# Altium schematic sheet Filter.SchDoc
size A3; SheetNumber: 1; SheetTotal: 1
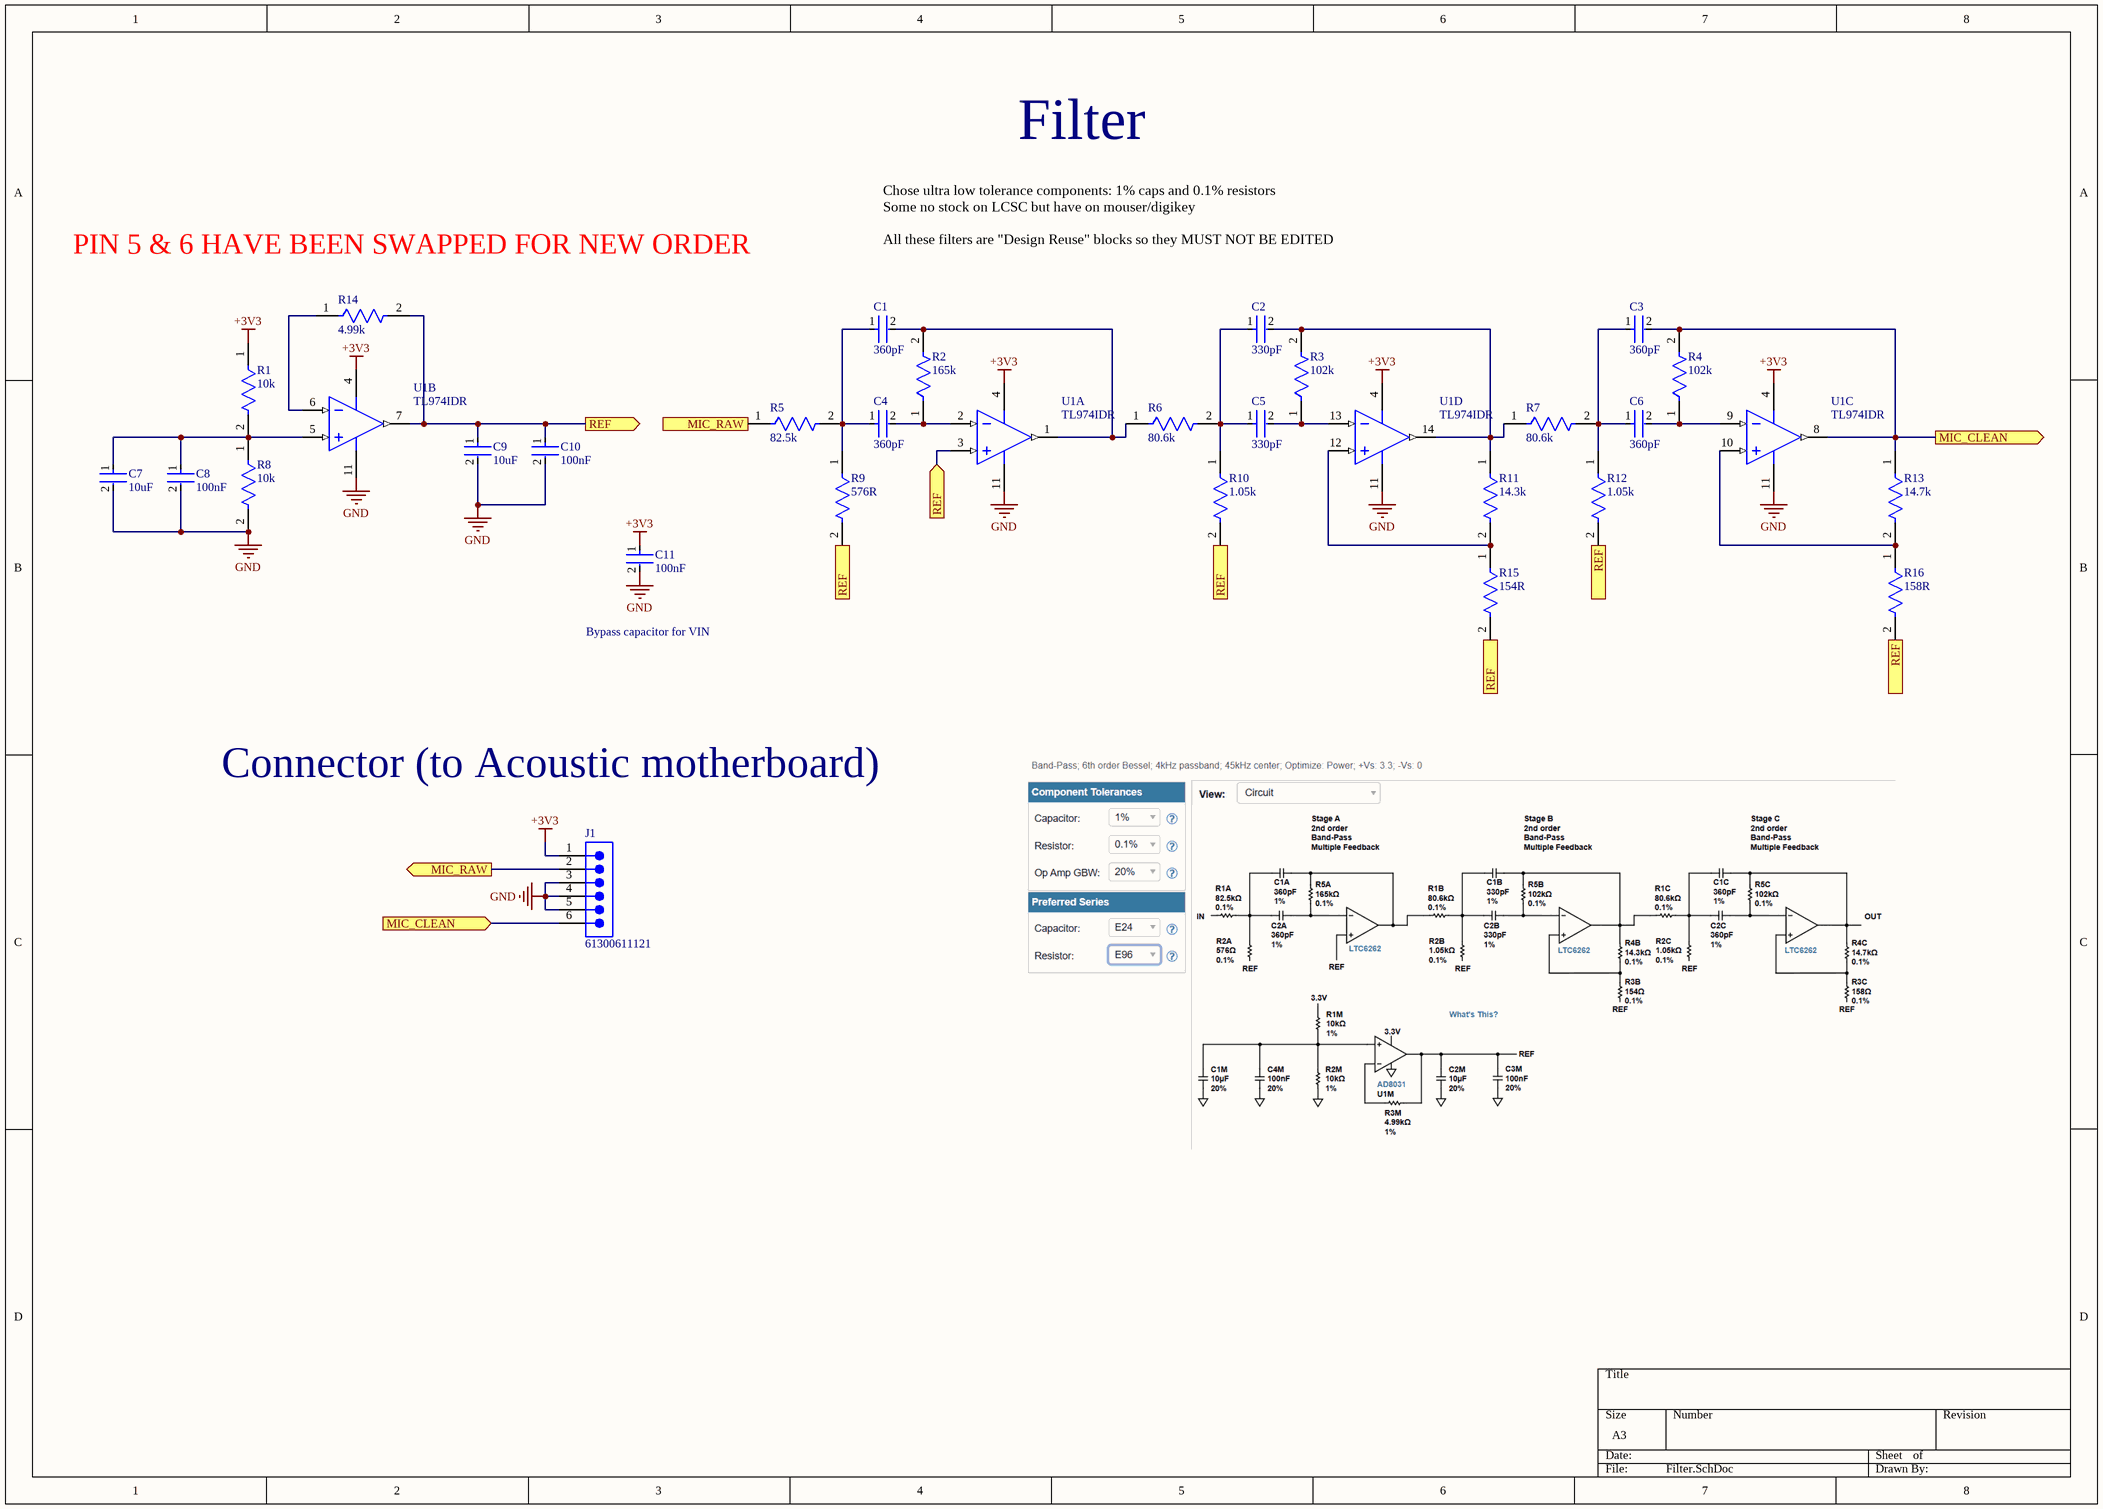
[diagram p0: Filter.SchDoc]

## Parts
C1  360pF  [FP-GCM188-0_1-IPC_B]
C2  330pF  [FP-GCM188-0_1-IPC_B]
C3  360pF  [FP-GCM188-0_1-IPC_B]
C4  360pF  [FP-GCM188-0_1-IPC_B]
C5  330pF  [FP-GCM188-0_1-IPC_B]
C6  360pF  [FP-GCM188-0_1-IPC_B]
C7  10uF  [FP-GCM188-0_1-IPC_B]
C8  100nF  [FP-GCM188-0_1-IPC_B]
C9  10uF  [FP-GCM188-0_1-IPC_B]
C10  100nF  [FP-GCM188-0_1-IPC_B]
C11  100nF  [FP-GCM188-0_1-IPC_B]
J1  61300611121  [61300611121-Footprint-1]
R1  10k  [FP-RT0603-IPC_B]
R2  165k  [FP-RT0603-IPC_B]
R3  102k  [FP-RT0603-IPC_B]
R4  102k  [FP-RT0603-IPC_B]
R5  82.5k  [FP-RT0603-IPC_B]
R6  80.6k  [FP-RT0603-IPC_B]
R7  80.6k  [FP-RT0603-IPC_B]
R8  10k  [FP-RT0603-IPC_B]
R9  576R  [FP-RT0603-IPC_B]
R10  1.05k  [FP-RT0603-IPC_B]
R11  14.3k  [FP-RT0603-IPC_B]
R12  1.05k  [FP-RT0603-IPC_B]
R13  14.7k  [FP-RT0603-IPC_B]
R14  4.99k  [FP-RT0603-IPC_B]
R15  154R  [FP-RT0603-IPC_B]
R16  158R  [FP-RT0603-IPC_B]
U1  TL974IDR  [D0014A_N]  (parts A,B,C,D of 4)

## Ports
MIC_CLEAN (in, see Filter[8B]), MIC_CLEAN (out, see Filter[2C]), MIC_RAW (in, see Filter[2C]), MIC_RAW (out, see Filter[3B]), REF (in, see Filter[3B], Filter[4B], Filter[5B], Filter[6B], Filter[7B]), REF (in, see Filter[3B], Filter[4B], Filter[5B], Filter[6B], Filter[7B], Filter[8B]), REF (in, see Filter[3B], Filter[4B], Filter[5B], Filter[6B], Filter[8B]), REF (in, see Filter[3B], Filter[4B], Filter[5B], Filter[7B], Filter[8B]), REF (in, see Filter[3B], Filter[4B], Filter[6B], Filter[7B], Filter[8B]), REF (out, see Filter[4B], Filter[5B], Filter[6B], Filter[7B], Filter[8B])

## Nets
+3V3: C11.1 J1.1 R1.1 U1.4(VCC+)
GND: C7.2 C8.2 C9.2 C10.2 C11.2 J1.3 J1.4 J1.5 R8.2 U1.11(VCC-)
MIC_CLEAN: C3.2 J1.6 R4.2 R13.1 U1.8(OUT3) ; port MIC_CLEAN
MIC_RAW: J1.2 R5.1 ; port MIC_RAW
REF: C9.1 C10.1 R9.2 R10.2 R12.2 R14.2 R15.2 R16.2 U1.3(IN1+) U1.7(OUT2) ; port REF
NetC1_1: C1.1 C4.1 R5.2 R9.1
NetC1_2: C1.2 R2.2 R6.1 U1.1(OUT1)
NetC2_1: C2.1 C5.1 R6.2 R10.1
NetC2_2: C2.2 R3.2 R7.1 R11.1 U1.14(OUT4)
NetC3_1: C3.1 C6.1 R7.2 R12.1
NetC4_2: C4.2 R2.1 U1.2(IN1-)
NetC5_2: C5.2 R3.1 U1.13(IN4-)
NetC6_2: C6.2 R4.1 U1.9(IN3-)
NetC7_1: C7.1 C8.1 R1.2 R8.1 U1.5(IN2+)
NetR11_2: R11.2 R15.1 U1.12(IN4+)
NetR13_2: R13.2 R16.1 U1.10(IN3+)
NetR14_1: R14.1 U1.6(IN2-)

## Notes on the sheet
- Filter
- Chose ultra low tolerance components: 1% caps and 0.1% resistors
  Some no stock on LCSC but have on mouser/digikey
  All these filters are "Design Reuse" blocks so they MUST NOT BE EDITED
- PIN 5 & 6 HAVE BEEN SWAPPED FOR NEW ORDER
- Bypass capacitor for VIN
- Connector (to Acoustic motherboard)

## Library data of the parts
C1 C3 C4 C6 = CMP-00016-1: Ceramic Capacitor, Multilayer, Ceramic, 100V, 1% +Tol, 1% -Tol, C0G, 30ppm/Cel TC, 0.00036uF, Surface Mount, 0603; Reference Standard: AEC-Q200; Multilayer: Yes; Packaging: Tape and Reel; Case/Package: 0603; Pins: 2; Temperature Characteristics Code: C0G; Termination: Wraparound; Min Operating Temperature: -55°C; Max Operating Temperature: 125°C; Capacitor Type: Ceramic; Value: 360pF; Tolerance (fill in as +-): 1%; RoHS Compliant: Yes; Dielectric Material: Ceramic; Rated DC Voltage (URdc): 100V; Reach SVHC Compliant: Yes; Mounting Technology: Surface Mount; Tolerance  (fill in as +-): 1%; Package Shape: Rectangular
C2 C5 = CMP-00012-1: Ceramic Capacitor, Multilayer, Ceramic, 50V, 1% +Tol, 1% -Tol, C0G, -/+30ppm/Cel TC, 0.00033uF, Surface Mount, 0603; Manufacturer Series: GRM18; Multilayer: Yes; Capacitor Type: Ceramic; Package Shape: Rectangular; Case/Package: 0603; Terminal Finish: Tin; Tolerance (fill in as +-): 1%; Packaging: Tape and Reel; Mounting Technology: Surface Mount; Max Operating Temperature: 125°C; Dielectric Material: Ceramic; Termination: Wraparound; Value: 330pF; Tolerance  (fill in as +-): 1%; Reach SVHC Compliant: Yes; RoHS Compliant: Yes; Min Operating Temperature: -55°C; JESD-609 Code: e3; Rated DC Voltage (URdc): 50V; Temperature Characteristics Code: C0G; Pins: 2
C7 C9 = CMP-00036-2: 25V 10uF Ceramic Capacitor, Multilayer, Ceramic, 25V, 10% +Tol, 10% -Tol, X5R, 15% TC, 10uF, Surface Mount, 0603; Multilayer: Yes; Max Operating Temperature: 85°C; Termination: Wraparound; Tolerance  (fill in as +-): 10%; Case/Package: 0603; Terminal Finish: Nickel; Pins: 2; Packaging: Tape and Reel; Temperature Characteristics Code: X5R; Value: 10uF; JESD-609 Code: e3; Mounting Technology: Surface Mount; Reach SVHC Compliant: Yes; Min Operating Temperature: -55°C; RoHS Compliant: Yes; Package Shape: Rectangular; Tolerance (fill in as +-): 10%; Capacitor Type: Ceramic; Dielectric Material: Ceramic; Rated DC Voltage (URdc): 25V
C8 C10 C11 = CMP-00033-2: 50V 100nF Ceramic Capacitor, Multilayer, Ceramic, 50V, 10% +Tol, 10% -Tol, X7R, 15% TC, 0.1uF, Surface Mount, 0603; Multilayer: Yes; Max Operating Temperature: 125°C; Tolerance (fill in as +-): 10%; Packaging: Tape and Reel; Min Operating Temperature: -55°C; Package Style: SMTMeter; Termination: Wraparound; Pins: 2; Dielectric Material: Ceramic; Temperature Characteristics Code: X7R; JESD-609 Code: e3; Width: 0.8mm; Rated DC Voltage (URdc): 50V; Package Shape: Rectangular; Case/Package: 0603; Length: 1.6mm; Height: 0.8mm; Reach SVHC Compliant: Yes; Value: 100nF; Capacitor Type: Ceramic; Tolerance  (fill in as +-): 10%; Terminal Finish: Nickel; Mounting Technology: Surface Mount; RoHS Compliant: Yes
J1 = CMP-00041-2: 6P Single Row 2.54mm Wurth Elektronik Header Pin (inverted 3D model); Reference Standard: UL; Dielectric Withstanding Voltage (AC): 500V; Contact Resistance: 20mR; Contact Style: SQ PIN-SKT; Mating Contact Pitch: 0.1inch; Contact Pattern: RECTANGULAR; Insulation Resistance: 1GR; Reliability: COMMERCIAL; Body Length: 0.6inch; Connector Type: BOARD CONNECTOR; Number of Contacts: 6; Rated Current (Signal): 3A; Mounting Option 1: LOCKING; Body/Shell Style: PLUG; Number Of Connectors: 1; System: Connector; RoHS Compliant: Yes; Contact Material: Copper Alloy; Min Operating Temperature: -40°C; Contact Finish - Termination: Gold (Au) - with Nickel (Ni) barrier; Terminal Length: 0.118inch; Contact Finish - Mating: GOLD; JESD-609 Code: e4; Body Depth: 0.1inch; Insulation Material: Polybutylene; Reach SVHC Compliant: Yes; Terminal Pitch: 2.54mm; PCB Contact Pattern: RECTANGULAR; Max Operating Temperature: 125°C; Mounting Style: STRAIGHT; Contact Gender: Male; Body Breadth: 0.1inch; Number of Rows Loaded: 1; Termination: Solder; Insulation Color: Black; Mounting Technology: Board
R1 R8 = CMP-00035-1: 10k 1% Fixed Resistor, Metal Glaze/thick Film, 0.1W, 10000ohm, 75V, 1% +/-Tol, 100ppm/Cel, Surface Mount, 0603; Power: 100mW; Temperature Coefficient (ppm/Cel): 100; Package Height: 0.45mm; Package Length: 1.6mm; Additional Feature: LASER TRIMMABLE; Package Width: 0.8mm; Value: 10kR; Rated Temperature: 70°C; Construction: Chip; Resistor Type: FIXED RESISTOR; Terminal Finish: Nickel; Mounting Technology: Surface Mount; Technology: METAL GLAZE/THICK FILM; Min Operating Temperature: -55°C; Pins: 2; Termination: Wraparound; Working Voltage: 75V; RoHS Compliant: Yes; Packaging: Tape and Reel; Case/Package: 0603; JESD-609 Code: e3; Package Shape: Rectangular; Reach SVHC Compliant: Yes; Max Operating Temperature: 155°C; Tolerance: 1%
R2 = CMP-00023-1: 165k Fixed Resistor, Thin Film, 0.1W, 165000ohm, 75V, 0.1% +/-Tol, 25ppm/Cel, Surface Mount, 0603; Rated Temperature: 70°C; Power: 100mW; Package Width: 0.8mm; Package Height: 0.45mm; Temperature Coefficient (ppm/Cel): 25; Value: 165kR; Package Length: 1.6mm; Min Operating Temperature: -55°C; Working Voltage: 75V; Termination: Wraparound; Pins: 2; Tolerance: 0.1%; Construction: Chip; Reach SVHC Compliant: Yes; Case/Package: 0603; Technology: THIN FILM; Resistor Type: FIXED RESISTOR; Packaging: Tape and Reel; RoHS Compliant: Yes; Mounting Technology: Surface Mount; Max Operating Temperature: 155°C
R3 R4 = CMP-00011-2: 102k Fixed Resistor, Thin Film, 0.1W, 102000ohm, 75V, 0.1% +/-Tol, 25ppm/Cel, Surface Mount, 0603; Package Length: 1.6mm; Value: 102kR; Package Width: 0.8mm; Power: 100mW; Temperature Coefficient (ppm/Cel): 25; Package Height: 0.45mm; Rated Temperature: 70°C; Pins: 2; RoHS Compliant: Yes; Mounting Technology: Surface Mount; Packaging: Tape and Reel; Min Operating Temperature: -55°C; Max Operating Temperature: 155°C; Tolerance: 0.1%; Resistor Type: FIXED RESISTOR; Case/Package: 0603; Technology: THIN FILM; Construction: Chip; Working Voltage: 75V; Termination: Wraparound; Reach SVHC Compliant: Yes
R5 = CMP-00022-2: 82.5k Fixed Resistor, Thin Film, 0.1W, 82500ohm, 75V, 0.1% +/-Tol, 25ppm/Cel, Surface Mount, 0603; Package Width: 0.8mm; Rated Temperature: 70°C; Value: 82.5kR; Temperature Coefficient (ppm/Cel): 25; Package Height: 0.45mm; Power: 100mW; Package Length: 1.6mm; Pins: 2; Working Voltage: 75V; Packaging: Tape and Reel; Construction: Chip; Reach SVHC Compliant: Yes; Tolerance: 0.1%; Termination: Wraparound; Technology: THIN FILM; Case/Package: 0603; Max Operating Temperature: 155°C; Min Operating Temperature: -55°C; Mounting Technology: Surface Mount; Resistor Type: FIXED RESISTOR; RoHS Compliant: Yes
R6 R7 = CMP-00025-2: 80.6k Fixed Resistor, Thin Film, 0.1W, 80600ohm, 75V, 0.1% +/-Tol, 25ppm/Cel, Surface Mount, 0603; Package Width: 0.8mm; Package Height: 0.45mm; Power: 100mW; Value: 80.6kR; Temperature Coefficient (ppm/Cel): 25; Package Length: 1.6mm; Rated Temperature: 70°C; Working Voltage: 75V; Mounting Technology: Surface Mount; Technology: THIN FILM; Construction: Chip; Tolerance: 0.1%; Reach SVHC Compliant: Yes; Resistor Type: FIXED RESISTOR; Pins: 2; Packaging: Tape and Reel; Max Operating Temperature: 155°C; Termination: Wraparound; RoHS Compliant: Yes; Min Operating Temperature: -55°C; Case/Package: 0603
R9 = CMP-00024-2: 576R Fixed Resistor, Thin Film, 0.1W, 576ohm, 75V, 0.1% +/-Tol, 25ppm/Cel, Surface Mount, 0603; Power: 100mW; Package Height: 0.45mm; Package Length: 1.6mm; Temperature Coefficient (ppm/Cel): 25; Rated Temperature: 70°C; Package Width: 0.8mm; RoHS Compliant: Yes; Mounting Technology: Surface Mount; Technology: THIN FILM; Value: 576R; Resistor Type: FIXED RESISTOR; Max Operating Temperature: 155°C; Termination: Wraparound; Pins: 2; Tolerance: 0.1%; Packaging: Tape and Reel; Reach SVHC Compliant: Yes; Min Operating Temperature: -55°C; Case/Package: 0603; Construction: Chip; Working Voltage: 75V
R10 R12 = CMP-00026-2: 1.05k Fixed Resistor, Thin Film, 0.1W, 1050ohm, 75V, 0.1% +/-Tol, 25ppm/Cel, Surface Mount, 0603; Package Width: 0.8mm; Rated Temperature: 70°C; Package Height: 0.45mm; Package Length: 1.6mm; Value: 1.05kR; Temperature Coefficient (ppm/Cel): 25; Power: 100mW; Mounting Technology: Surface Mount; Pins: 2; Max Operating Temperature: 155°C; Packaging: Tape and Reel; Tolerance: 0.1%; Reach SVHC Compliant: Yes; Construction: Chip; Working Voltage: 75V; Min Operating Temperature: -55°C; Termination: Wraparound; RoHS Compliant: Yes; Resistor Type: FIXED RESISTOR; Technology: THIN FILM; Case/Package: 0603
R11 = CMP-00029-1: 14.3k Fixed Resistor, Thin Film, 0.1W, 14300ohm, 75V, 0.1% +/-Tol, 25ppm/Cel, Surface Mount, 0603; Temperature Coefficient (ppm/Cel): 25; Value: 14.3kR; Package Width: 0.8mm; Rated Temperature: 70°C; Power: 100mW; Package Length: 1.6mm; Package Height: 0.45mm; Construction: Chip; Max Operating Temperature: 155°C; RoHS Compliant: Yes; Technology: THIN FILM; Mounting Technology: Surface Mount; Min Operating Temperature: -55°C; Working Voltage: 75V; Case/Package: 0603; Pins: 2; Resistor Type: FIXED RESISTOR; Tolerance: 0.1%; Packaging: Tape and Reel; Termination: Wraparound; Reach SVHC Compliant: Yes
R13 = CMP-00027-2: 14.7k Fixed Resistor, Thin Film, 0.1W, 14700ohm, 75V, 0.1% +/-Tol, 25ppm/Cel, Surface Mount, 0603; Rated Temperature: 70°C; Temperature Coefficient (ppm/Cel): 25; Package Height: 0.45mm; Package Width: 0.8mm; Value: 14.7kR; Package Length: 1.6mm; Power: 100mW; Termination: Wraparound; Tolerance: 0.1%; Pins: 2; Mounting Technology: Surface Mount; Case/Package: 0603; Min Operating Temperature: -55°C; Resistor Type: FIXED RESISTOR; Construction: Chip; Packaging: Tape and Reel; Technology: THIN FILM; Working Voltage: 75V; Reach SVHC Compliant: Yes; Max Operating Temperature: 155°C; RoHS Compliant: Yes
R14 = CMP-00037-1: 4.99k 1% Fixed Resistor, Metal Glaze/thick Film, 0.1W, 4990ohm, 75V, 1% +/-Tol, 100ppm/Cel, Surface Mount, 0603; Value: 4.99kR; Package Length: 1.6mm; Additional Feature: LASER TRIMMABLE; Temperature Coefficient (ppm/Cel): 100; Package Width: 0.8mm; Package Height: 0.45mm; Rated Temperature: 70°C; Power: 100mW; Construction: Chip; Resistor Type: FIXED RESISTOR; Working Voltage: 75V; Case/Package: 0603; Min Operating Temperature: -55°C; Tolerance: 1%; Package Shape: Rectangular; Mounting Technology: Surface Mount; RoHS Compliant: Yes; Max Operating Temperature: 155°C; Pins: 2; Terminal Finish: Nickel; Termination: Wraparound; Reach SVHC Compliant: Yes; Technology: METAL GLAZE/THICK FILM; Packaging: Tape and Reel; JESD-609 Code: e3
R15 = CMP-00030-1: 154R Fixed Resistor, Thin Film, 0.1W, 154ohm, 75V, 0.1% +/-Tol, 25ppm/Cel, Surface Mount, 0603; Rated Temperature: 70°C; Package Width: 0.8mm; Power: 100mW; Package Height: 0.45mm; Temperature Coefficient (ppm/Cel): 25; Package Length: 1.6mm; Construction: Chip; Reach SVHC Compliant: Yes; Packaging: Tape and Reel; Termination: Wraparound; Pins: 2; RoHS Compliant: Yes; Value: 154R; Min Operating Temperature: -55°C; Case/Package: 0603; Mounting Technology: Surface Mount; Technology: THIN FILM; Working Voltage: 75V; Tolerance: 0.1%; Max Operating Temperature: 155°C; Resistor Type: FIXED RESISTOR
R16 = CMP-00028-2: 158R Fixed Resistor, Thin Film, 0.1W, 158ohm, 75V, 0.1% +/-Tol, 25ppm/Cel, Surface Mount, 0603; Package Length: 1.6mm; Rated Temperature: 70°C; Power: 100mW; Temperature Coefficient (ppm/Cel): 25; Package Height: 0.45mm; Package Width: 0.8mm; Resistor Type: FIXED RESISTOR; Value: 158R; Working Voltage: 75V; Termination: Wraparound; Min Operating Temperature: -55°C; Packaging: Tape and Reel; Construction: Chip; Technology: THIN FILM; Max Operating Temperature: 155°C; RoHS Compliant: Yes; Case/Package: 0603; Mounting Technology: Surface Mount; Tolerance: 0.1%; Pins: 2; Reach SVHC Compliant: Yes
U1 = CMP-00044-1: Operational Amplifier, 4 Func, 6000uV Offset-Max, BIPolar, PDSO14; Supply Voltage Limit-Max: 15V; Package Body Material: Plastic; Neg Supply Voltage-Nom (Vsup): -2.5V; Bias Current-Max (IIB) @25C: 750nA; Channels: 4; Architecture: VOLTAGE-FEEDBACK; Unity Gain BW-Nom: 12MHz; Slew Rate: 5V/µs; Input Offset Voltage-Max: 6mV; Slew Rate-Min: 3.5V/µs; Frequency Compensation: YES; Qualification Status: Not Qualified; Common-mode Reject Ratio-Nom: 85dB; Nominal Supply Voltage: 2.5V; Max Supply Current: 12.8mA; Voltage Gain-Min: 3160; Low-Offset: No; Average Bias Current-Max (IIB): 1uA; Package Equivalence Code: SOP14,.25; Power Supplies: +-2.5V; Amplifier Type: OPERATIONAL AMPLIFIER; Terminal Finish: Nickel; Terminal Pitch: 1.27mm; Terminal Form: Gull Wing; Height - Seated (Max): 1.75mm; Packaging: Tape and Reel; Pins: 14; Max Operating Temperature: 125°C; Technology: BIPOLAR; Moisture Sensitivity Level: 1; Terminal Position: DUAL; Width: 3.9mm; Peak Reflow Temperature (Cel): 260°C; Reach SVHC Compliant: Yes; Temperature Grade: AUTOMOTIVE; Package Shape: Rectangular; RoHS Compliant: Yes; Package Style: SMALL OUTLINEMeter; JESD-30 Code: R-PDSO-G14; JESD-609 Code: e4; Surface Mount: Yes; Case/Package: SOP; Min Operating Temperature: -40°C; Length: 8.65mm